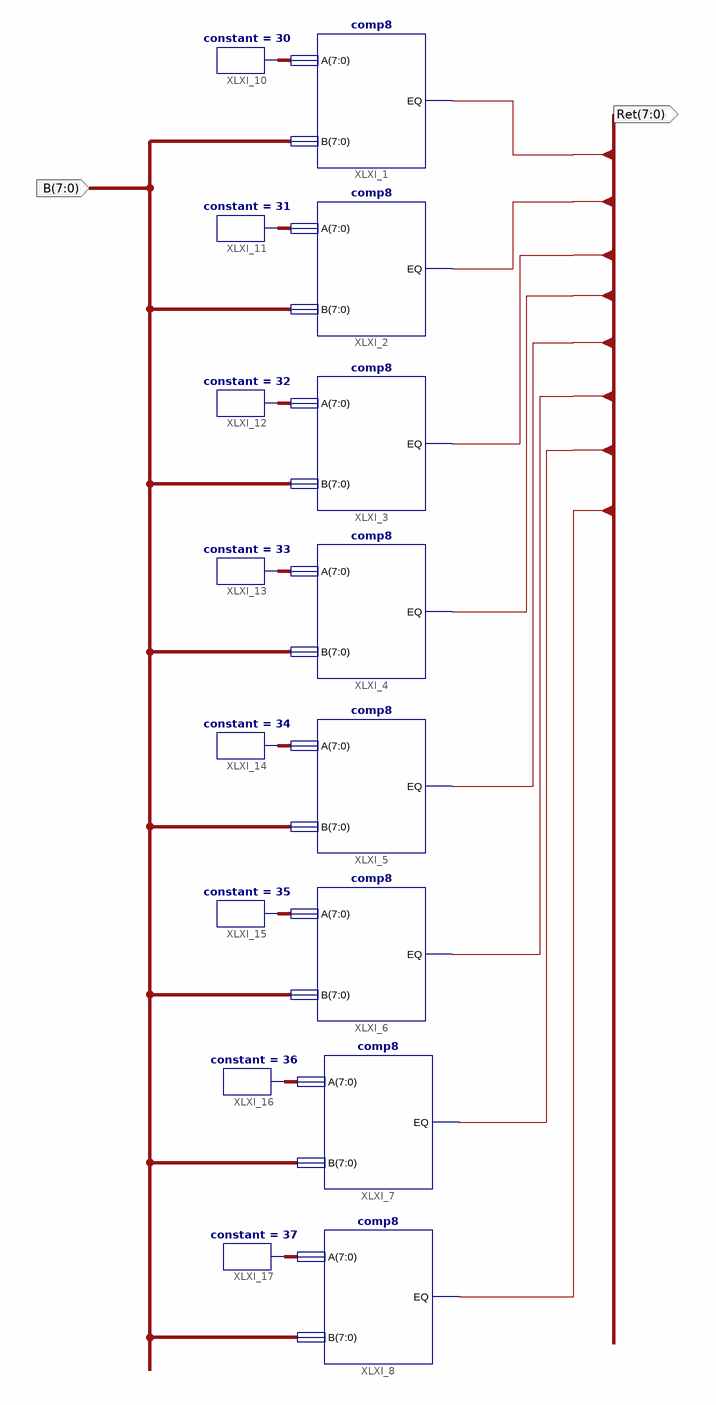
[diagram p0: schematic sheet 1]
// Xilinx ISE schematic keyboard_key_resolver.sch (spartan3e) as structural Verilog: 16 symbols, 2 ports
module keyboard_key_resolver (
  input  [7:0] B,
  output [7:0] Ret
);

  wire [7:0] XLXN_3, XLXN_4, XLXN_5, XLXN_6, XLXN_7, XLXN_8, XLXN_9, XLXN_10;

  comp8 XLXI_1 (.A(XLXN_3), .B(B), .EQ(Ret[0]));
  comp8 XLXI_2 (.A(XLXN_4), .B(B), .EQ(Ret[1]));
  comp8 XLXI_3 (.A(XLXN_5), .B(B), .EQ(Ret[2]));
  comp8 XLXI_4 (.A(XLXN_6), .B(B), .EQ(Ret[3]));
  comp8 XLXI_5 (.A(XLXN_7), .B(B), .EQ(Ret[4]));
  comp8 XLXI_6 (.A(XLXN_8), .B(B), .EQ(Ret[5]));
  comp8 XLXI_7 (.A(XLXN_9), .B(B), .EQ(Ret[6]));
  comp8 XLXI_8 (.A(XLXN_10), .B(B), .EQ(Ret[7]));
  constant #(.CValue("30")) XLXI_10 (.O(XLXN_3));
  constant #(.CValue("31")) XLXI_11 (.O(XLXN_4));
  constant #(.CValue("32")) XLXI_12 (.O(XLXN_5));
  constant #(.CValue("33")) XLXI_13 (.O(XLXN_6));
  constant #(.CValue("34")) XLXI_14 (.O(XLXN_7));
  constant #(.CValue("35")) XLXI_15 (.O(XLXN_8));
  constant #(.CValue("36")) XLXI_16 (.O(XLXN_9));
  constant #(.CValue("37")) XLXI_17 (.O(XLXN_10));
endmodule
